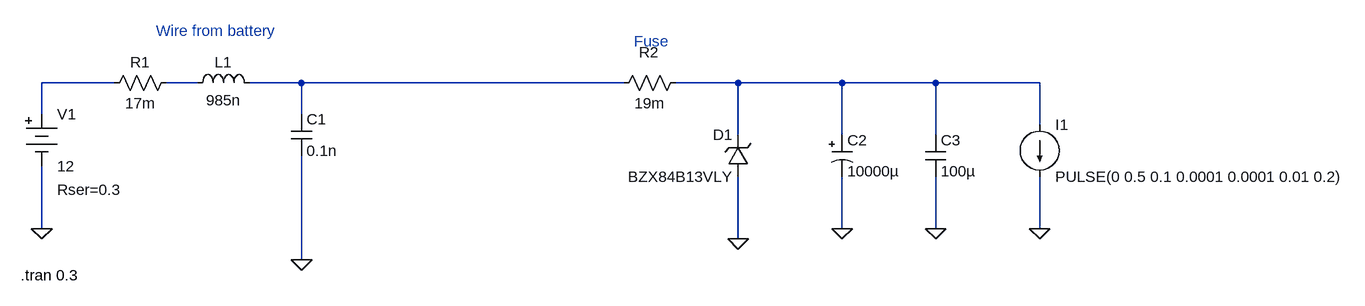
[diagram p0: schematic simu.asc]
simu.asc, the LTspice schematic file:
Version 4
SHEET 1 2084 680
WIRE 160 64 48 64
WIRE 288 64 240 64
WIRE 448 64 368 64
WIRE 944 64 448 64
WIRE 1120 64 1024 64
WIRE 1280 64 1120 64
WIRE 1424 64 1280 64
WIRE 1584 64 1424 64
WIRE 48 112 48 64
WIRE 448 112 448 64
WIRE 1584 128 1584 64
WIRE 1120 144 1120 64
WIRE 1280 144 1280 64
WIRE 1424 144 1424 64
WIRE 48 288 48 192
WIRE 1280 288 1280 208
WIRE 1424 288 1424 208
WIRE 1584 288 1584 208
WIRE 1120 304 1120 208
WIRE 448 336 448 176
FLAG 48 288 0
FLAG 448 336 0
FLAG 1120 304 0
FLAG 1280 288 0
FLAG 1584 288 0
FLAG 1424 288 0
SYMBOL Misc\\battery 48 96 R0
WINDOW 123 0 0 Left 0
WINDOW 39 24 132 Left 2
SYMATTR SpiceLine Rser=0.3
SYMATTR InstName V1
SYMATTR Value 12
SYMBOL res 144 80 R270
WINDOW 0 32 56 VTop 2
WINDOW 3 0 56 VBottom 2
SYMATTR InstName R1
SYMATTR Value 17m
SYMBOL ind 272 80 R270
WINDOW 0 32 56 VTop 2
WINDOW 3 5 56 VBottom 2
SYMATTR InstName L1
SYMATTR Value 985n
SYMBOL cap 432 112 R0
SYMATTR InstName C1
SYMATTR Value 0.1n
SYMBOL res 1040 48 R90
WINDOW 0 -16 57 VBottom 2
WINDOW 3 32 56 VTop 2
SYMATTR InstName R2
SYMATTR Value 19m
SYMBOL zener 1136 208 R180
WINDOW 0 24 64 Left 2
WINDOW 3 24 0 Left 2
SYMATTR InstName D1
SYMATTR Value BZX84B13VLY
SYMATTR Description Diode
SYMATTR Type diode
SYMBOL polcap 1264 144 R0
WINDOW 3 24 56 Left 2
SYMATTR Value 10000µ
SYMATTR InstName C2
SYMATTR Description Capacitor
SYMATTR Type cap
SYMATTR SpiceLine V=63 Irms=4.69 Rser=0.0175 Lser=20.255n mfg="Würth Elektronik" pn="861140786024 WCAP-AI3H 35x52" type="Al electrolytic"
SYMBOL current 1584 128 R0
WINDOW 123 0 0 Left 0
WINDOW 39 0 0 Left 0
SYMATTR InstName I1
SYMATTR Value PULSE(0 0.5 0.1 0.0001 0.0001 0.01 0.2)
SYMBOL cap 1408 144 R0
SYMATTR InstName C3
SYMATTR Value 100µ
SYMATTR SpiceLine V=16 Irms=4.8 Rser=0.0064 Lser=3.543n mfg="Würth Elektronik" pn="870135373001 WCAP-PTHT 6,3 x 11" type="Al polymer"
TEXT 224 -16 Left 2 ;Wire from battery
TEXT 960 0 Left 2 ;Fuse
TEXT 16 360 Left 2 !.tran 0.3

The netlist it stands for:
* simu.asc
V1 N001 0 12 Rser=0.3
R1 N001 N002 17m
L1 N002 N003 985n
C1 N003 0 0.1n
R2 N004 N003 19m
D1 0 N004 BZX84B13VLY
C2 N004 0 10000µ V=63 Irms=4.69 Rser=0.0175 Lser=20.255n mfg="Würth Elektronik" pn="861140786024 WCAP-AI3H 35x52" type="Al electrolytic"
I1 N004 0 PULSE(0 0.5 0.1 0.0001 0.0001 0.01 0.2)
C3 N004 0 100µ V=16 Irms=4.8 Rser=0.0064 Lser=3.543n mfg="Würth Elektronik" pn="870135373001 WCAP-PTHT 6,3 x 11" type="Al polymer"
.model D D
.lib standard.dio
* Wire from battery
* Fuse
.tran 0.3
.backanno
.end